# Altium project MAGI's7SegmentDisplay.PrjPcb
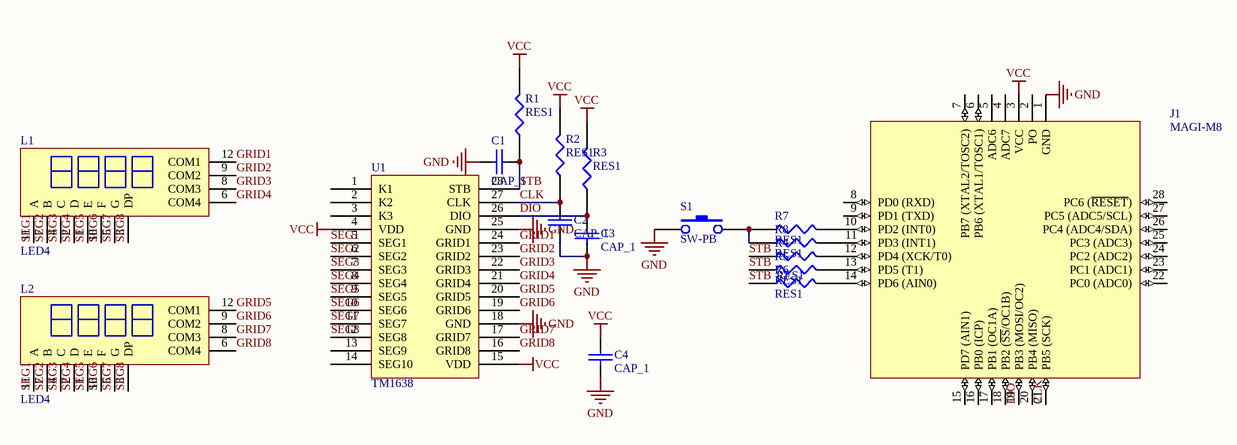
[diagram p0: MAGI's7SegmentDisplay.SchDoc]
1 sheet, 17 parts. Net scope: global (net labels, ports and power ports of the same name join across sheets).
Board file: MAGI's7SegmentDisplay.PcbDoc

## Sheet MAGI's7SegmentDisplay.SchDoc
size A4

### Parts
C1  CAP_1  [6-0805_N]
C2  CAP_1  [6-0805_N]
C3  CAP_1  [6-0805_N]
C4  CAP_1  [6-0805_N]
J1  MAGI-M8  [MAGI-M8]
L1  LED4  [0.36"LED]
L2  LED4  [0.36"LED]
R1  RES1  [6-0805_N]
R2  RES1  [6-0805_N]
R3  RES1  [6-0805_N]
R4  RES1  [1608[0603]]
R5  RES1  [1608[0603]]
R6  RES1  [1608[0603]]
R7  RES1  [1608[0603]]
R8  RES1  [1608[0603]]
S1  SW-PB  [SW-1-SMD]
U1  TM1638  [TM1638]

### Nets
GND: C1.2 C2.1 C3.1 C4.2 J1.1(GND) S1.1 U1.18(GND) U1.25(GND)
VCC: C4.1 J1.3(VCC) R1.2 R2.2 R3.2 U1.4(VDD) U1.15(VDD)
CLK: C2.2 J1.21(PB5_(SCK)) R2.1 U1.27(CLK)
DIO: C3.2 J1.19(PB3_(MOSI/OC2)) R3.1 U1.26(DIO)
GRID1: L1.12(COM1) U1.24(GRID1)
GRID2: L1.9(COM2) U1.23(GRID2)
GRID3: L1.8(COM3) U1.22(GRID3)
GRID4: L1.6(COM4) U1.21(GRID4)
GRID5: L2.12(COM1) U1.20(GRID5)
GRID6: L2.9(COM2) U1.19(GRID6)
GRID7: L2.8(COM3) U1.17(GRID7)
GRID8: L2.6(COM4) U1.16(GRID8)
SEG1: L1.11(A) L2.11(A) U1.5(SEG1)
SEG2: L1.7(B) L2.7(B) U1.6(SEG2)
SEG3: L1.4(C) L2.4(C) U1.7(SEG3)
SEG4: L1.2(D) L2.2(D) U1.8(SEG4)
SEG5: L1.1(E) L2.1(E) U1.9(SEG5)
SEG6: L1.10(F) L2.10(F) U1.10(SEG6)
SEG7: L1.5(G) L2.5(G) U1.11(SEG7)
SEG8: L1.3(DP) L2.3(DP) U1.12(SEG8)
STB: C1.1 R1.1 R4.1 R5.1 R6.1 U1.28(STB)
NetJ1_10: J1.10(PD2_(INT0)) R7.2
NetJ1_11: J1.11(PD3_(INT1)) R8.2
NetJ1_12: J1.12(PD4_(XCK/T0)) R4.2
NetJ1_13: J1.13(PD5_(T1)) R5.2
NetJ1_14: J1.14(PD6_(AIN0)) R6.2
NetR7_1: R7.1 R8.1 S1.2

Not connected (* = marked no-connect by the designer): J1 2(PO) 4(ADC7) 5(ADC6) 6(PB6_(XTAL1/TOSC1)) 7(PB7_(XTAL2/TOSC2)) 8(PD0_(RXD)) 9(PD1_(TXD)) 15(PD7_(AIN1)) 16(PB0_(ICP)) 17(PB1_(OC1A)) 18(PB2_(~{SS}/OC1B)) 20(PB4_(MISO)) 22(PC0_(ADC0)) 23(PC1_(ADC1)) 24(PC2_(ADC2)) 25(PC3_(ADC3)) 26(PC4_(ADC4/SDA)) 27(PC5_(ADC5/SCL)) 28(PC6_(~{RESET})); U1 1(K1) 2(K2) 3(K3) 13(SEG9) 14(SEG10)

### Library data of the parts
C1-C4 = CAP_1: Capacitor